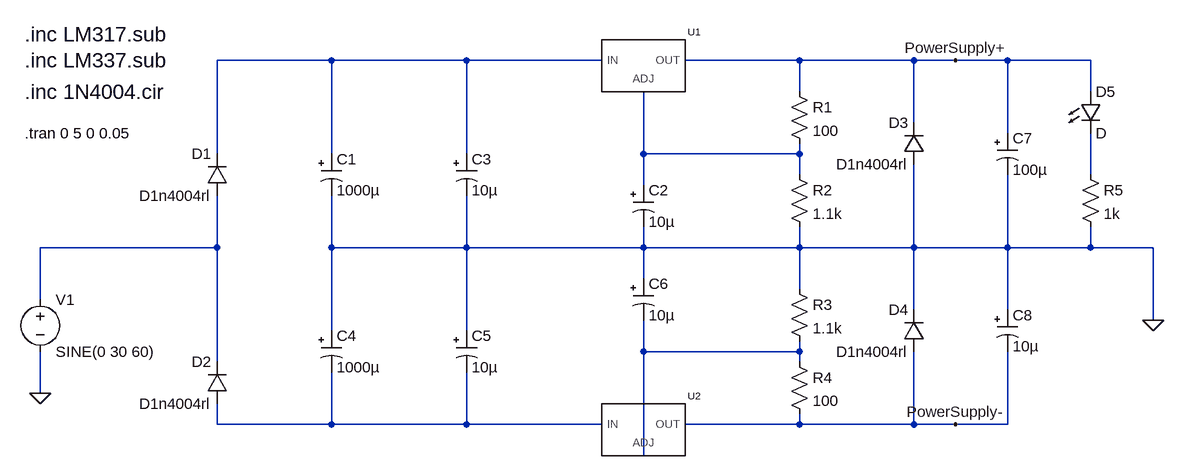
[diagram p0: schematic power_supply.asc]
power_supply.asc, the LTspice schematic file:
Version 4
SHEET 1 2060 1032
WIRE 64 -32 -112 -32
WIRE 272 -32 64 -32
WIRE 480 -32 272 -32
WIRE 784 -32 608 -32
WIRE 960 -32 784 -32
WIRE 1024 -32 960 -32
WIRE 1104 -32 1024 -32
WIRE 1232 -32 1104 -32
WIRE 784 16 784 -32
WIRE 1232 16 1232 -32
WIRE 960 64 960 -32
WIRE 1104 80 1104 -32
WIRE -112 112 -112 -32
WIRE 64 112 64 -32
WIRE 272 112 272 -32
WIRE 544 112 544 16
WIRE 784 112 784 96
WIRE 784 112 544 112
WIRE 784 144 784 112
WIRE 1232 144 1232 80
WIRE 544 160 544 112
WIRE -112 256 -112 176
WIRE -112 256 -384 256
WIRE 64 256 64 176
WIRE 272 256 272 176
WIRE 272 256 64 256
WIRE 544 256 544 224
WIRE 544 256 272 256
WIRE 784 256 784 224
WIRE 784 256 544 256
WIRE 960 256 960 128
WIRE 960 256 784 256
WIRE 1104 256 1104 144
WIRE 1104 256 960 256
WIRE 1232 256 1232 224
WIRE 1232 256 1104 256
WIRE 1328 256 1232 256
WIRE 544 304 544 256
WIRE 784 320 784 256
WIRE -384 336 -384 256
WIRE 960 352 960 256
WIRE 1104 352 1104 256
WIRE 1328 368 1328 256
WIRE 64 384 64 256
WIRE 272 384 272 256
WIRE 544 416 544 368
WIRE 784 416 784 400
WIRE 784 416 544 416
WIRE -112 432 -112 256
WIRE 784 432 784 416
WIRE -384 480 -384 416
WIRE -112 528 -112 496
WIRE 64 528 64 448
WIRE 64 528 -112 528
WIRE 272 528 272 448
WIRE 272 528 64 528
WIRE 480 528 272 528
WIRE 784 528 784 512
WIRE 784 528 608 528
WIRE 960 528 960 416
WIRE 960 528 784 528
WIRE 1024 528 960 528
WIRE 1104 528 1104 416
WIRE 1104 528 1024 528
WIRE 544 576 544 416
FLAG -384 480 0
FLAG 1328 368 0
FLAG 1024 -32 PowerSupply+
FLAG 1024 528 PowerSupply-
SYMBOL polcap 48 112 R0
WINDOW 3 24 56 Left 2
SYMATTR Value 1000µ
SYMATTR InstName C1
SYMATTR Description Capacitor
SYMATTR Type cap
SYMATTR SpiceLine V=100 Irms=1.33 Rser=0.047 Lser=0
SYMBOL res 768 0 R0
SYMATTR InstName R1
SYMATTR Value 100
SYMBOL res 768 128 R0
SYMATTR InstName R2
SYMATTR Value 1.1k
SYMBOL voltage -384 320 R0
WINDOW 123 0 0 Left 2
WINDOW 39 0 0 Left 2
SYMATTR InstName V1
SYMATTR Value SINE(0 30 60)
SYMBOL polcap 256 112 R0
SYMATTR InstName C3
SYMATTR Value 10µ
SYMBOL lm317 544 -32 R0
SYMATTR InstName U1
SYMBOL diode -96 176 R180
WINDOW 0 24 64 Left 2
WINDOW 3 24 0 Left 2
SYMATTR InstName D1
SYMATTR Value D1n4004rl
SYMBOL polcap 528 160 R0
SYMATTR InstName C2
SYMATTR Value 10µ
SYMBOL diode -96 496 R180
WINDOW 0 24 64 Left 2
WINDOW 3 24 0 Left 2
SYMATTR InstName D2
SYMATTR Value D1n4004rl
SYMBOL polcap 48 384 R0
WINDOW 3 24 56 Left 2
SYMATTR Value 1000µ
SYMATTR InstName C4
SYMATTR Description Capacitor
SYMATTR Type cap
SYMATTR SpiceLine V=100 Irms=1.33 Rser=0.047 Lser=0 mfg="Nichicon" pn="UPR2A102MRH" type="Al electrolytic"
SYMBOL polcap 256 384 R0
SYMATTR InstName C5
SYMATTR Value 10µ
SYMBOL polcap 528 304 R0
SYMATTR InstName C6
SYMATTR Value 10µ
SYMBOL res 768 304 R0
SYMATTR InstName R3
SYMATTR Value 1.1k
SYMBOL res 768 416 R0
SYMATTR InstName R4
SYMATTR Value 100
SYMBOL lm317 544 528 R0
SYMATTR InstName U2
SYMATTR Value LM337
SYMATTR Value2 LM337
SYMBOL diode 976 128 R180
WINDOW 0 24 64 Left 2
WINDOW 3 24 0 Left 2
SYMATTR InstName D3
SYMATTR Value D1n4004rl
SYMBOL diode 976 416 R180
WINDOW 0 24 64 Left 2
WINDOW 3 24 0 Left 2
SYMATTR InstName D4
SYMATTR Value D1n4004rl
SYMBOL polcap 1088 80 R0
SYMATTR InstName C7
SYMATTR Value 100µ
SYMBOL polcap 1088 352 R0
SYMATTR InstName C8
SYMATTR Value 10µ
SYMBOL LED 1216 16 R0
SYMATTR InstName D5
SYMBOL res 1216 128 R0
SYMATTR InstName R5
SYMATTR Value 1k
TEXT -408 16 Left 3 !.inc 1N4004.cir
TEXT -408 -32 Left 3 !.inc LM337.sub
TEXT -408 -72 Left 3 !.inc LM317.sub
TEXT -408 80 Left 2 !.tran 0 5 0 0.05

The netlist it stands for:
* power_supply.asc
C1 N001 0 1000µ V=100 Irms=1.33 Rser=0.047 Lser=0
R1 PowerSupply+ N002 100
R2 N002 0 1.1k
V1 N004 0 SINE(0 30 60)
C3 N001 0 10µ
XU1 N001 N002 PowerSupply+ LM317 LM317  ; pins IN ADJ OUT
D1 N004 N001 D1n4004rl
C2 N002 0 10µ
D2 N006 N004 D1n4004rl
C4 0 N006 1000µ V=100 Irms=1.33 Rser=0.047 Lser=0 mfg="Nichicon" pn="UPR2A102MRH" type="Al electrolytic"
C5 0 N006 10µ
C6 0 N005 10µ
R3 0 N005 1.1k
R4 N005 PowerSupply- 100
XU2 N006 N005 PowerSupply- LM337 LM337  ; pins IN ADJ OUT
D3 0 PowerSupply+ D1n4004rl
D4 PowerSupply- 0 D1n4004rl
C7 PowerSupply+ 0 100µ
C8 0 PowerSupply- 10µ
D5 PowerSupply+ N003 D
R5 N003 0 1k
.model D D
.lib standard.dio
.inc 1N4004.cir
.inc LM337.sub
.inc LM317.sub
.tran 0 5 0 0.05
.lib LM317.sub
.backanno
.end